# Altium schematic sheet SD.SchDoc
size A4; SheetNumber: 10; SheetTotal: 13
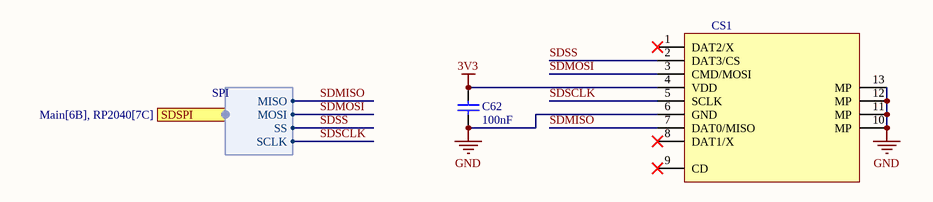
[diagram p0: SD.SchDoc]

## Parts
C62  100nF  [WCAP-CSGP_0603_L1.6W0.8H0.8_Reflow]
CS1  MicroSD TF Card  [MicroSD TF Card Slot]  (value not drawn)

## Ports
SDSPI (harness SPI, see Main[6B], RP2040[7C])

## Harnesses
SPI: MISO, MOSI, SS, SCLK

## Nets
3V3: C62.2 CS1.4(VDD)
GND: C62.1 CS1.6(GND) CS1.10(MP) CS1.11(MP) CS1.12(MP) CS1.13(MP)
SDMISO: CS1.7(DAT0/MISO) ; port SDSPI.MISO
SDMOSI: CS1.3(CMD/MOSI) ; port SDSPI.MOSI
SDSCLK: CS1.5(SCLK) ; port SDSPI.SCLK
SDSS: CS1.2(DAT3/CS) ; port SDSPI.SS

Not connected (* = marked no-connect by the designer): CS1 1(DAT2/X)* 8(DAT1/X)* 9(CD)*

## Library data of the parts
C62 = 885012206095: WCAP-CSGP Multilayer Ceramic Chip Capacitor, General Purpose, size 0603, X7R, 100nF, 50VDC; Manufacturer: Wurth Elektronik; Case/Size Code: 0603; Capacitance Tolerance: +/-10%; Dissipation Factor: 3%; Insulation Resistance: 5GΩ; Rated Voltage (DC): 50V; Technical Reference: X7R0603104K050DFCT10000; Manufacturer Part Number: 885012206095; Category: Multilayer Ceramic Chip Capacitors; Match Code: WCAP-CSGP; ComponentLink1Description: Website Link; ComponentLink1URL: https://www.we-online.com/redexpert/article/885012206095?ad; ComponentLink2Description: Datasheet Link; ComponentLink2URL: https://www.we-online.com/redexpert/spec/885012206095?ad; Mount: Surface Mount; Operating Temperature Max: 125°C; Operating Temperature Min: -55°C; Packaging: Tape and Reel; Length: 1.6mm; Width: 0.8mm; Height: 0.8mm; Capacitance: 100nF; Ceramic Type: X7R
CS1 = MicroSD TF Card: SHOU HAN TF-CARD H1.8